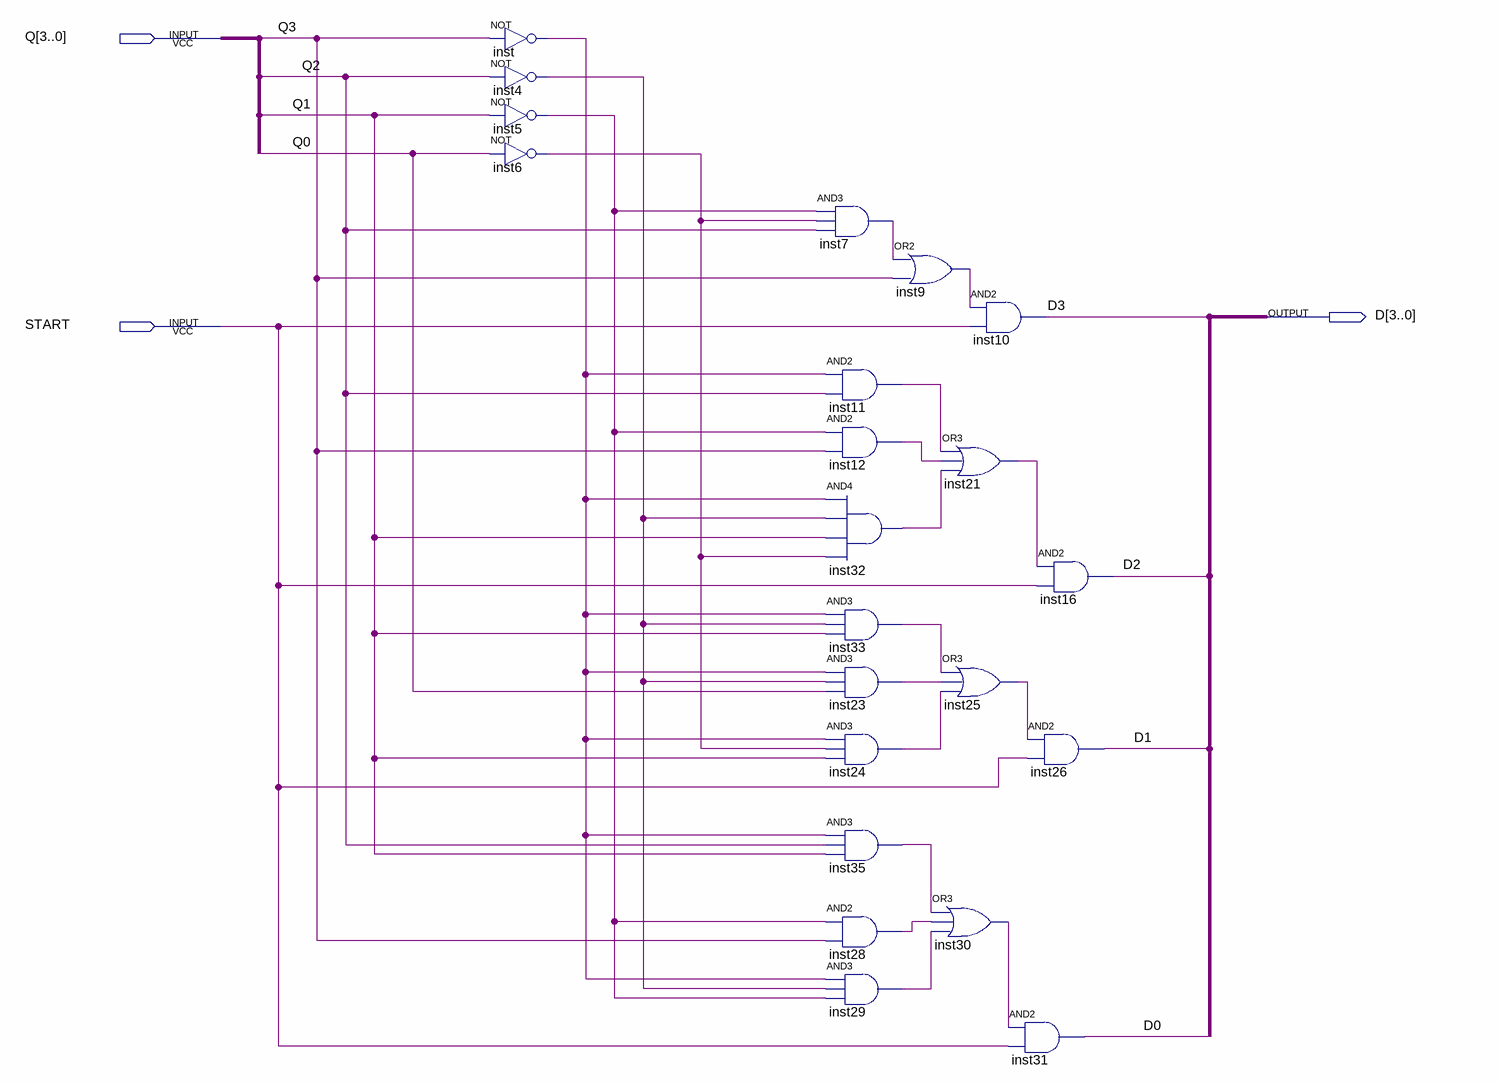
[diagram p0: schematic sheet]
// Quartus schematic NextStateLogic.bdf as structural Verilog: 22 symbols, 3 pins
module NextStateLogic (
  input  [3:0] Q,
  input  START,
  output [3:0] D
);

  wire inst4_out, inst5_out, inst6_out, inst7_out, inst9_out, inst11_out, inst12_out, inst21_out, inst23_out,
       inst24_out, inst25_out, inst28_out, inst29_out, inst30_out, inst32_out, inst33_out, inst35_out,
       inst_out;

  not inst (inst_out, Q[3]);
  not inst4 (inst4_out, Q[2]);
  not inst5 (inst5_out, Q[1]);
  not inst6 (inst6_out, Q[0]);
  and inst7 (inst7_out, inst5_out, inst6_out, Q[2]);
  or inst9 (inst9_out, inst7_out, Q[3]);
  and inst11 (inst11_out, inst_out, Q[2]);
  and inst12 (inst12_out, inst5_out, Q[3]);
  and inst32 (inst32_out, inst_out, inst4_out, Q[1], inst6_out);
  and inst33 (inst33_out, inst_out, inst4_out, Q[1]);
  and inst23 (inst23_out, inst_out, inst4_out, Q[0]);
  and inst24 (inst24_out, inst_out, inst6_out, Q[1]);
  and inst35 (inst35_out, inst_out, Q[2], Q[1]);
  and inst28 (inst28_out, inst5_out, Q[3]);
  and inst29 (inst29_out, inst_out, inst4_out, inst5_out);
  and inst10 (D[3], inst9_out, START);
  or inst21 (inst21_out, inst11_out, inst12_out, inst32_out);
  or inst25 (inst25_out, inst33_out, inst23_out, inst24_out);
  or inst30 (inst30_out, inst35_out, inst28_out, inst29_out);
  and inst16 (D[2], inst21_out, START);
  and inst26 (D[1], inst25_out, START);
  and inst31 (D[0], inst30_out, START);
endmodule
